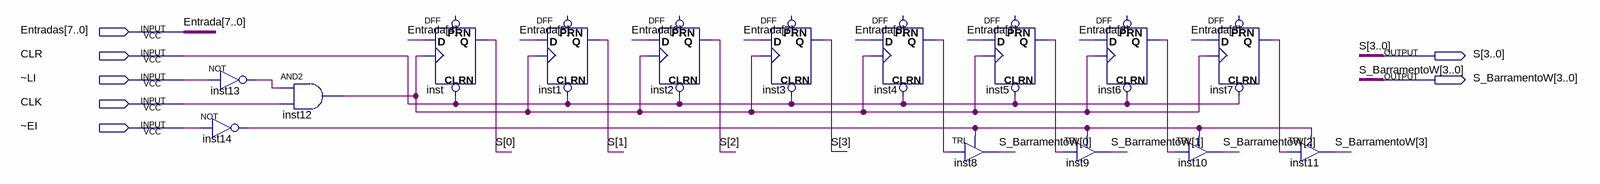
[diagram p0: schematic sheet]
// Quartus schematic Registrador_De_Instrucoes.bdf as structural Verilog: 15 symbols, 7 pins
module Registrador_De_Instrucoes (
  input  [7:0] Entradas,
  input  CLR,
  input  \~LI ,
  input  CLK,
  input  \~EI ,
  output [3:0] S,
  output [3:0] S_BarramentoW
);

  wire inst4_q, inst5_q, inst6_q, inst7_q, inst12_out, inst13_out, inst14_out;

  not inst13 (inst13_out, \~LI );
  not inst14 (inst14_out, \~EI );
  and inst12 (inst12_out, inst13_out, CLK);
  DFF inst (.CLRN(CLR), .CLK(inst12_out), .D(Entradas[4]), .Q(S[0]));  // open: PRN
  DFF inst1 (.CLRN(CLR), .CLK(inst12_out), .D(Entradas[5]), .Q(S[1]));  // open: PRN
  DFF inst2 (.CLRN(CLR), .CLK(inst12_out), .D(Entradas[6]), .Q(S[2]));  // open: PRN
  DFF inst3 (.CLRN(CLR), .CLK(inst12_out), .D(Entradas[7]), .Q(S[3]));  // open: PRN
  DFF inst4 (.CLRN(CLR), .CLK(inst12_out), .D(Entradas[0]), .Q(inst4_q));  // open: PRN
  TRI inst8 (.IN(inst4_q), .OE(inst14_out), .OUT(S_BarramentoW[0]));
  DFF inst5 (.CLRN(CLR), .CLK(inst12_out), .D(Entradas[1]), .Q(inst5_q));  // open: PRN
  DFF inst6 (.CLRN(CLR), .CLK(inst12_out), .D(Entradas[2]), .Q(inst6_q));  // open: PRN
  TRI inst9 (.IN(inst5_q), .OE(inst14_out), .OUT(S_BarramentoW[1]));
  DFF inst7 (.CLRN(CLR), .CLK(inst12_out), .D(Entradas[3]), .Q(inst7_q));  // open: PRN
  TRI inst10 (.IN(inst6_q), .OE(inst14_out), .OUT(S_BarramentoW[2]));
  TRI inst11 (.IN(inst7_q), .OE(inst14_out), .OUT(S_BarramentoW[3]));

  // Other names for the same wires on the sheet: Entrada[7:0] = Entradas
endmodule
